# Altium schematic sheet MAIN Schematic.SchDoc
size A4
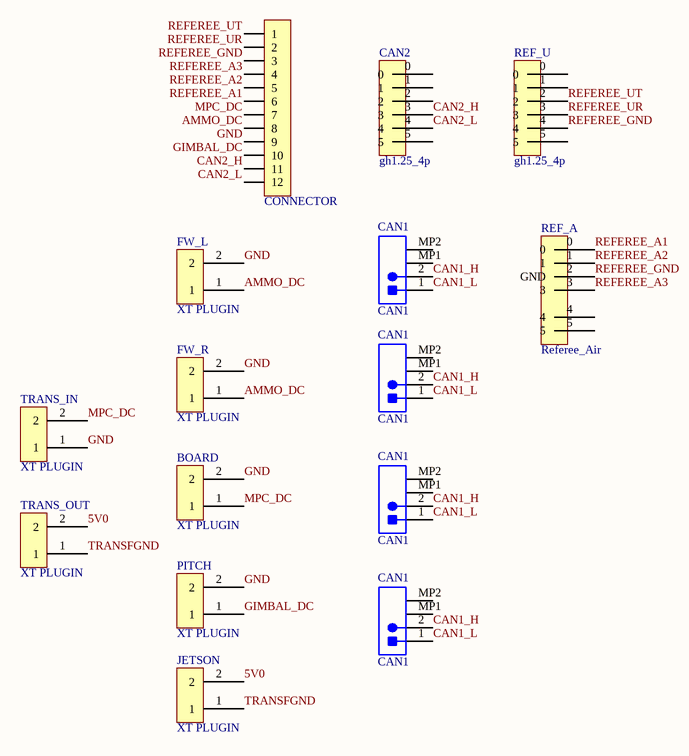
[diagram p0: MAIN Schematic.SchDoc]

## Parts
(Parts that share a designator on the sheet are numbered #1, #2 ... from top to bottom, then left to right.)
BOARD  XT PLUGIN  [XT30-M]
CAN1#1  CAN1  [JST-BM02B-GHS-TBT_V]
CAN1#2  CAN1  [JST-BM02B-GHS-TBT_V]
CAN1#3  CAN1  [JST-BM02B-GHS-TBT_V]
CAN1#4  CAN1  [JST-BM02B-GHS-TBT_V]
CAN2  gh1.25_4p  [GH1.25-LS-4P]
CONNECTOR  HDR-1X12  [HT3.96-LI-12P]  (value not drawn)
FW_L  XT PLUGIN  [XT30-M]
FW_R  XT PLUGIN  [XT30-M]
JETSON  XT PLUGIN  [XT30-M]
PITCH  XT PLUGIN  [XT30-M]
REF_A  Referee_Air  [M8 Connector]
REF_U  gh1.25_4p  [GH1.25-LS-4P]
TRANS_IN  XT PLUGIN  [XT30-M]
TRANS_OUT  XT PLUGIN  [XT30-M]

## Nets
5V0: JETSON.2 TRANS_OUT.2
AMMO_DC: CONNECTOR.8 FW_L.1 FW_R.1
CAN1_H: CAN1#1.2 CAN1#2.2 CAN1#3.2 CAN1#4.2
CAN1_L: CAN1#1.1 CAN1#2.1 CAN1#3.1 CAN1#4.1
CAN2_H: CAN2.3 CONNECTOR.11
CAN2_L: CAN2.4 CONNECTOR.12
GIMBAL_DC: CONNECTOR.10 PITCH.1
GND: BOARD.2 CONNECTOR.9 FW_L.2 FW_R.2 PITCH.2 TRANS_IN.1
MPC_DC: BOARD.1 CONNECTOR.7 TRANS_IN.2
REFEREE_A1: CONNECTOR.6 REF_A.0
REFEREE_A2: CONNECTOR.5 REF_A.1
REFEREE_A3: CONNECTOR.4 REF_A.3
REFEREE_GND: CONNECTOR.3 REF_A.2(GND) REF_U.4
REFEREE_UR: CONNECTOR.2 REF_U.3
REFEREE_UT: CONNECTOR.1 REF_U.2
TRANSFGND: JETSON.1 TRANS_OUT.1

Not connected (* = marked no-connect by the designer): CAN1#1 MP1 MP2; CAN1#2 MP1 MP2; CAN1#3 MP1 MP2; CAN1#4 MP1 MP2; CAN2 0 1 2 5; REF_A 4 5; REF_U 0 1 5

## Library data of the parts
CAN1#1-CAN1#4 = CMP-2000-05957-1: Disconnectable Crimp Style Connector, Pitch 1.25 mm, 1 x 2 Position, Height 4.05 mm, -25 to 85 degC, RoHS, Tape and Reel; Manufacturer: JST-Sales-America-Inc.; Connector Type: Header,Shrouded; Number of Positions Loaded: All; Pitch: 0.049"(1.25mm); Number of Positions: 2; Family: RectangularConnectors-Headers,MalePins; Contact Finish: Tin; Contact Type: OuterShroudContact; Number of Rows: 1; Row Spacing: -; Datasheet Version: 05/2016; Fastening Type: LockingRamp; Contact Mating Length: -; Packaging: Digi-Reel®; Manufacturer URL: http://www.jst.com/home2.html; Termination: Solder; Package Description: Disconnectable Crimp Style Connector, Pitch 1.25 mm, 1 x 2 Position, Height 4.05 mm; Features: SolderRetention; Color: Natural; Datasheet URL: http://www.jst-mfg.com/product/pdf/eng/eGH.pdf; Package Reference: BM02B-GHS-TBT; Series: GH; Contact Finish Thickness: -; Mounting Type: SurfaceMount; Mounting Technology: SurfaceMount; Category: Connectors,Interconnects
CONNECTOR = Header 12: 12P接插件; 版权归属: 封装库来自淘宝卖家 ID：黄晶宝石; BOM名称: 12P接插件; 学习资源: https://shop463601444.taobao.com